# Altium schematic sheet DC309A_External_Sync.SchDoc: External_Sync
size 558 x 431 mm; Date: Not shown in title block; ApprovedBy: Not shown in title block; CheckedBy: Not shown in title block; Author: Not shown in title block; CompanyName: Not shown in title block; DrawnBy: KAVIKANNAN; Engineer: Not shown in title block; Organization: Not shown in title block; Address1: Not shown in title block; Address2: Not shown in title block; Address3: Not shown in title block; Address4: Not shown in title block; DocumentNumber: 8; Revision: Use project parameter SCH_Rev; SheetNumber: 8; SheetTotal: 11; PageSetup: Record=PageOptions|CenterHorizontal=True|CenterVertical=True|PrintScale=1.00|XCorrection=1.00|YCorrection=1.00|PrintKind=0|BorderSize=5000000|LeftOffset=0|BottomOffset=0|Orientation=2|PaperLength=1000|PaperWidth=1000|Scale=100|PaperSource=15|PrintQuality=600|MediaType=1|DitherType=10|PaperKind=Letter|PrintScaleMode=1; CurrentTime: Not shown in title block; CurrentDate: Not shown in title block; Time: Not shown in title block; DocumentFullPathAndName: Not shown in title block; DocumentName: Not shown in title block; ModifiedDate: Not shown in title block; ImagePath: Not shown in title block
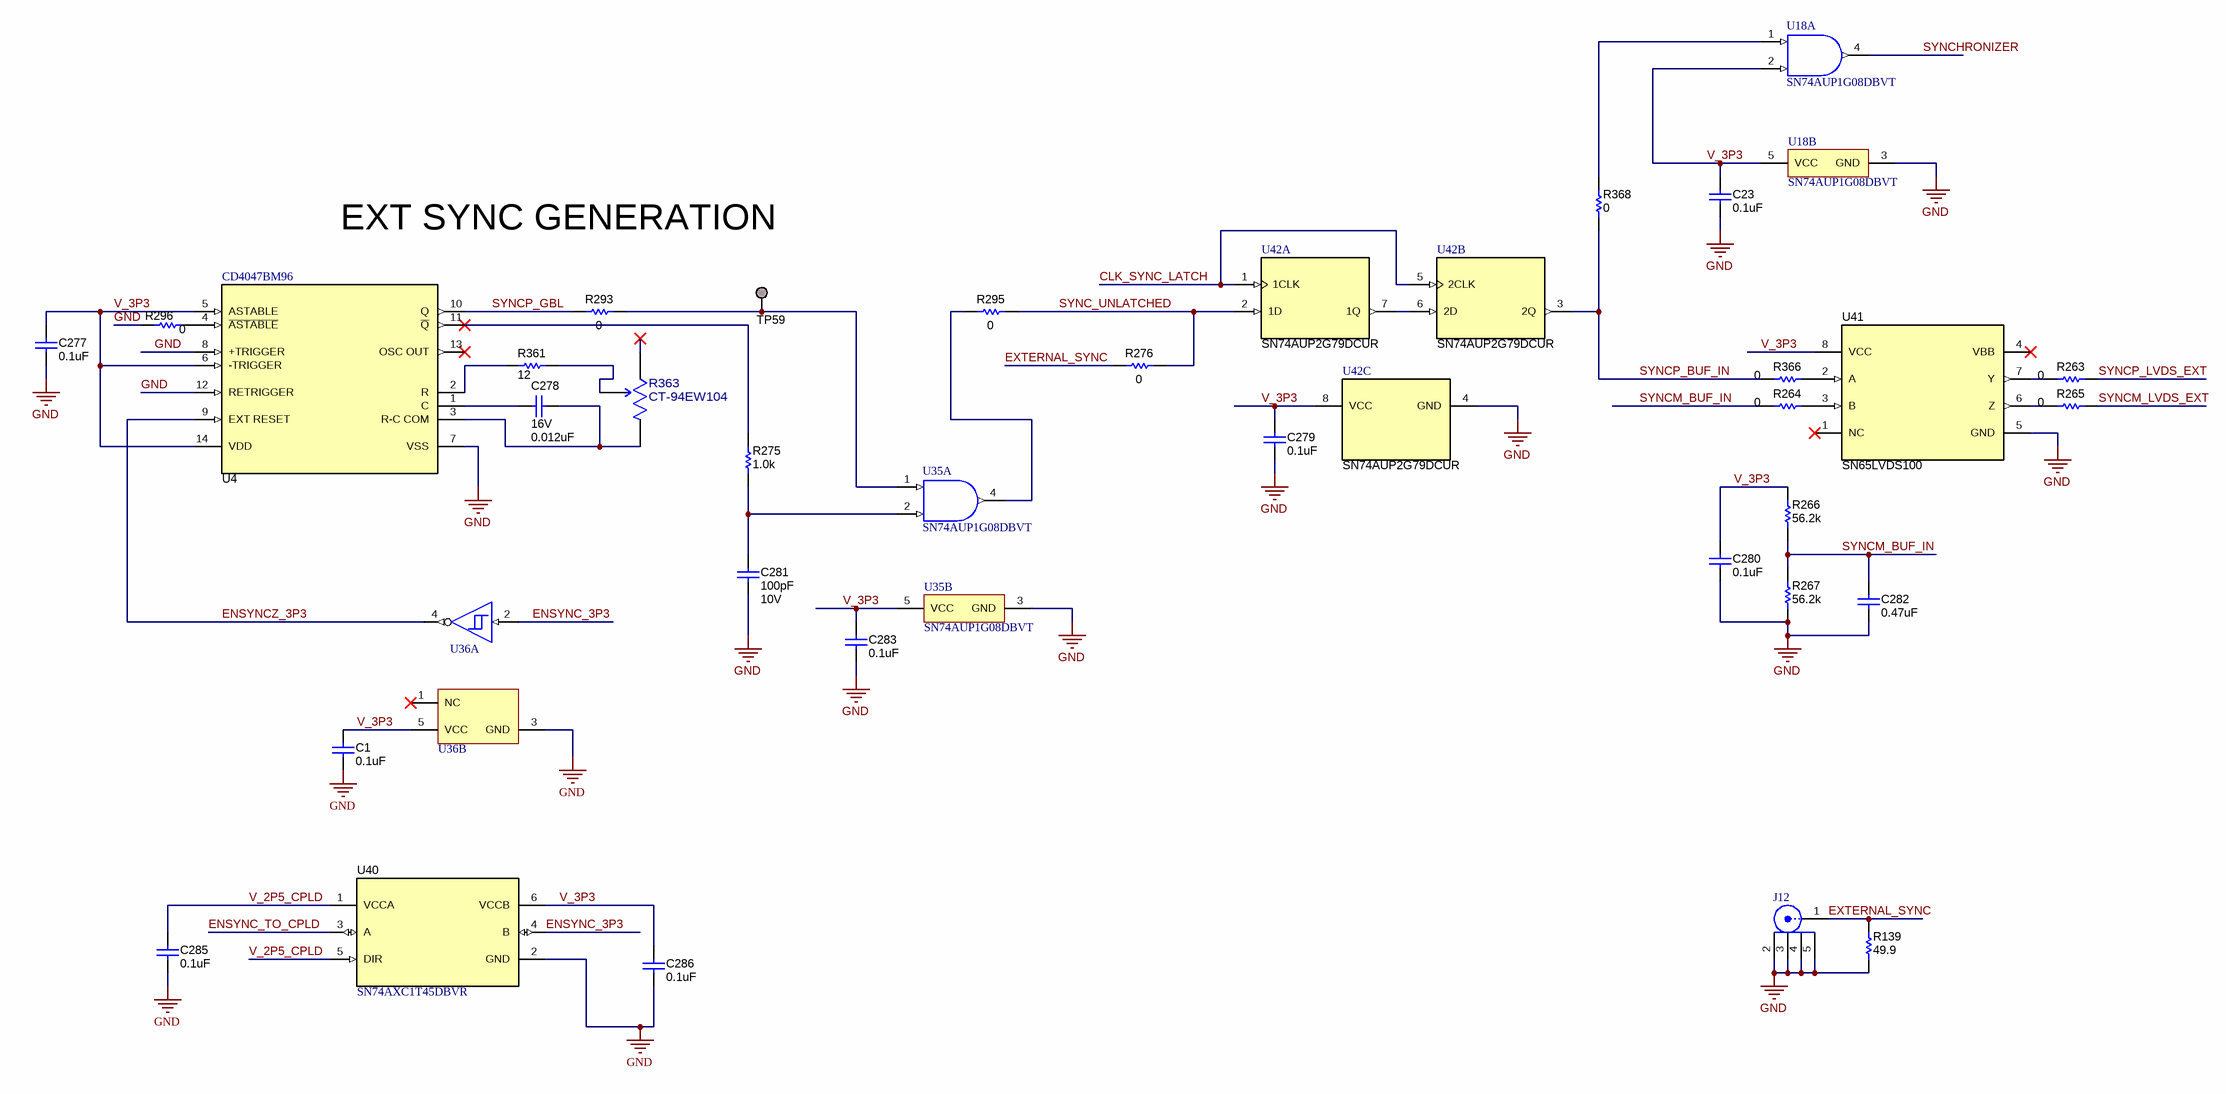
[diagram p0: DC309A_External_Sync.SchDoc]

## Parts
C1  value 0.1uF  [0402]  (hidden comment: Capacitor)
C23  ValueDisplayed: 0.1uF  [0402]  (hidden comment: Capacitor)
C277  ValueDisplayed: 0.1uF  [0402]  (hidden comment: Capacitor)
C278  VDC_V: 16V  ValueDisplayed: 0.012uF  [0402]  (hidden comment: GRM155R71C123KA01D)
C279  ValueDisplayed: 0.1uF  [0402]  (hidden comment: Capacitor)
C280  ValueDisplayed: 0.1uF  [0402]  (hidden comment: Capacitor)
C281  Cap_F: 100pF  VDC_V: 10V  [0603]  (hidden comment: 0603ZC101KAT2A)
C282  ValueDisplayed: 0.47uF  [0402]  (hidden comment: Capacitor)
C283  ValueDisplayed: 0.1uF  [0402]  (hidden comment: Capacitor)
C285  value 0.1uF  [0402]  (hidden comment: Capacitor)
C286  value 0.1uF  [0402]  (hidden comment: Capacitor)
J12  901-144-8RFX  [AMPHENOL_901-144-8RFX]  (value not drawn)
R139  ValueDisplayed: 49.9  [TNPW0603]  (hidden comment: TNPW060349R9BEEA)
R263  value 0  [0402]  (hidden comment: Resistor)
R264  value 0  [0402]  (hidden comment: Resistor)
R265  value 0  [0402]  (hidden comment: Resistor)
R266  ValueDisplayed: 56.2k  [0402]  (hidden comment: Resistor)
R267  ValueDisplayed: 56.2k  [0402]  (hidden comment: Resistor)
R275  ValueDisplayed: 1.0k  [0402]  (hidden comment: CRCW04021K00JNED)
R276  value 0  [0402]  (hidden comment: Resistor)
R293  value 0  [0402]  (hidden comment: Resistor)
R295  value 0  [0402]  (hidden comment: Resistor)
R296  ValueDisplayed: 0  [0402]  (hidden comment: Resistor)
R361  ValueDisplayed: 12  [0402]  (hidden comment: CRCW040212R0JNED)
R363  CT-94EW104  [FP-CT-94EW104_PTH_POTEN_9MM6_4MM8-MFG]
R366  value 0  [0402]  (hidden comment: Resistor)
R368  value 0  [0402]  (hidden comment: Resistor)
TP59  Test Point  [TP_50MIL-SMT]  (value not drawn)  (no BOM)
U4  CD4047BM96  [D0014A_N]
U18  SN74AUP1G08DBVT  [DBV0005A_N]  (parts A,B of 2)
U35  SN74AUP1G08DBVT  [DBV0005A_N]  (parts A,B of 2)
U36  SN74LVC1G14DBVR  [DBV0005A_N]  (value not drawn)  (parts A,B of 2)
U40  SN74AXC1T45DBVR  [DBV0006A_N]
U41  SN65LVDS100  [DGK0008A_N]
U42  SN74AUP2G79DCUR  [DCU0008A_N]  (parts A,B,C of 3)

## Nets
GND: C1.1 C23.2 C277.2 C279.2 C280.2 C281.1 C282.2 C283.2 C285.1 C286.1 J12.2 J12.3 J12.4 J12.5 R139.1 R267.1 R296.1 U4.7(VSS) U4.8(+TRIGGER) U4.12(RETRIGGER) U18.3(GND) U35.3(GND) U36.3(GND) U40.2(GND) U41.5(GND) U42.4(GND)
CLK_SYNC_LATCH: U42.1(1CLK) U42.5(2CLK)
ENSYNC_3P3: U36.2(A) U40.4(B)
ENSYNC_TO_CPLD: U40.3(A)
ENSYNCZ_3P3: U4.9(EXT_RESET) U36.4(Y)
EXTERNAL_SYNC: J12.1 R139.2 R276.2
SYNC_UNLATCHED: R276.1 R295.1 U42.2(1D)
SYNCHRONIZER: U18.4(Y)
SYNCM_BUF_IN: C282.1 R264.2 R266.1 R267.2
SYNCM_LVDS_EXT: R265.1
SYNCP_BUF_IN: R366.2 R368.1 U42.3(2Q)
SYNCP_GBL: R293.2 U4.10(Q)
SYNCP_LVDS_EXT: R263.1
V_2P5_CPLD: C285.2 U40.1(VCCA) U40.5(DIR)
V_3P3: C1.2 C23.1 C277.1 C279.1 C280.1 C283.1 C286.2 R266.2 U4.5(ASTABLE) U4.6(-TRIGGER) U4.14(VDD) U18.2(B) U18.5(VCC) U35.5(VCC) U36.5(VCC) U40.6(VCCB) U41.8(VCC) U42.8(VCC)
NetC278_1: C278.1 R363.3 U4.3(R-C_COM)
NetC278_2: C278.2 U4.1(C)
NetC281_2: C281.2 R275.2 U35.2(B)
NetR263_2: R263.2 U41.7(Y)
NetR264_1: R264.1 U41.3(B)
NetR265_2: R265.2 U41.6(Z)
NetR275_1: R275.1 U4.11(~{Q})
NetR293_1: R293.1 TP59.1 U35.1(A)
NetR295_2: R295.2 U35.4(Y)
NetR296_2: R296.2 U4.4(~{ASTABLE})
NetR361_1: R361.1 U4.2(R)
NetR361_2: R361.2 R363.2
NetR366_1: R366.1 U41.2(A)
NetR368_2: R368.2 U18.1(A)
NetU42_6: U42.6(2D) U42.7(1Q)

Not connected (* = marked no-connect by the designer): R363 1*; U4 13(OSC_OUT)*; U36 1(NC)*; U41 1(NC)* 4(VBB)*

## Notes on the sheet
- EXT SYNC GENERATION
- Drawn By:
- SVN Rev:
- Number:
- TID #:
- Orderable:
- Rev:
- Sheet Title:
- File:
- Project Title:
- Designed for:
- Assembly Variant:
- Mod. Date:
- Sheet:
- Size:
- of
- C
- http://www.ti.com
- Texas Instruments and/or its licensors do not warrant the accuracy or completeness of this specification or any information contained therein. Texas Instruments and/or its licensors do not warrant that this design will meet the specifications, will be suitable for your application or fit for any particular purpose, or will operate in an implementation. Texas Instruments and/or its licensors do not warrant that the design is production worthy. You should completely validate and test your design implementation to confirm the system functionality for your application.
- Engineer:
- Contact:
- © Texas Instruments

## Library data of the parts
C1 C285 C286 = CMP-0006641-2: CAP, CERM, 0.1 uF, 16 V, +/- 10%, X7R, 0402; PartNumber: GRM155R71C104KA88D; Manufacturer: MuRata; Polarized: N; U/M: EA; Cap_F: 100nF; Value1: Unknown; VDC_V: 16V; TaMin_C: -55°C; TaMax_C: 125°C; AEC Category: Q200; SizeArea_mm2: 0.5; SizeAreaWB_mm2: 3; SizeX_mm: 1; SizeZ_mm: 0.6; CompType: Capacitor; PackageReference: 0402; RoHS: Y; MountType: SMT; ComponentLink1Description: Datasheet link; ComponentLink1URL: http://search.murata.co.jp/Ceramy/PnsearchViewAction.do?HnOFG=ON&HnNFG=ON&SEL_CNT=50&sLang=en&sKey=GRM155R71C104KA88D&x=9&y=9&search=startwith; ValueDisplayed: 0.1uF; Tolerance_%: 10%; Value2: 16V; Technology: Ceramic; TempCo: X7R; Cap_Case: 0402; Published: 2008-06-19; Publisher: Texas Instruments; LatestRevisionDate: 2017-03-09; Supplier 1: Digi-Key; Supplier Part Number 1: 490-3261-1-ND; Supplier 2: Newark; Supplier Part Number 2: 38K1647; Supplier 3: Mouser; Supplier Part Number 3: 81-GRM155R71C104KA88; AEC Qualified: ?; SizeY_mm: 0.5
C23 C279 C280 C283 = CMP-0006201-2: CAP, CERM, 0.1 uF, 16 V, +/- 10%, X7R, 0402; PartNumber: 0402YC104KAT2A; Manufacturer: AVX; Polarized: N; Value: 0.1uF; U/M: EA; Cap_F: 100nF; Value1: Unknown; VDC_V: 16V; TaMin_C: -55°C; TaMax_C: 125°C; SizeArea_mm2: 0.5; SizeAreaWB_mm2: 3; SizeX_mm: 1; SizeZ_mm: 0.6; AEC Category: Q200; CompType: Capacitor; PackageReference: 0402; RoHS: Y; Tolerance_%: 10%; Value2: 16V; MountType: SMT; Technology: Ceramic; TempCo: X7R; Cap_Case: 0402; SizeY_mm: 0.5; Published: 2008-06-19; Publisher: Texas Instruments; LatestRevisionDate: 2017-03-09; ComponentLink1Description: Datasheet link; ComponentLink1URL: http://catalogs.avx.com/SurfaceMount.pdf; Supplier 1: Digi-Key; Supplier Part Number 1: 478-7888-1-ND; Supplier 2: Newark; Supplier Part Number 2: 09R7024; Supplier 3: Mouser; Supplier Part Number 3: 581-0402YC104KAT2A; AEC Qualified: N; AEC Grade: N/A
C277 = CMP-0006255-2: CAP, CERM, 0.1 uF, 6.3 V, +/- 10%, X5R, 0402; PartNumber: C1005X5R0J104K050BA; Manufacturer: TDK; Polarized: N; Value: 0.1uF; U/M: EA; Cap_F: 100nF; ESR_ohm: 0.0186; Value1: 0.0186 ohm; VDC_V: 6.3V; TaMin_C: -55°C; TaMax_C: 85°C; SizeArea_mm2: 0.5; SizeAreaWB_mm2: 3; SizeX_mm: 1; SizeZ_mm: 0.6; AEC Category: Q200; CompType: Capacitor; PackageReference: 0402; RoHS: Y; Tolerance_%: 10%; Value2: 6.3V; MountType: SMT; Technology: Ceramic; TempCo: X5R; Cap_Case: 0402; SizeY_mm: 0.5; Published: 2008-06-19; Publisher: Texas Instruments; LatestRevisionDate: 2017-03-09; ComponentLink1Description: Datasheet link; ComponentLink1URL: http://www.tdk.co.jp/tefe02/e412_c.pdf; Supplier 1: Digi-Key; Supplier Part Number 1: 445-1266-1-ND; Supplier 2: Newark; Supplier Part Number 2: 90R7579; Supplier 3: Mouser; Supplier Part Number 3: 810-C1005X5R0J104K; AEC Qualified: ?
C278 = CMP-0006642-2: CAP, CERM, 0.012 uF, 16 V, +/- 10%, X7R, 0402; Manufacturer: MuRata; TaMin_C: -55°C; Polarized: N; SizeAreaWB_mm2: 3; Value1: Unknown; U/M: EA; TaMax_C: 125°C; SizeZ_mm: 0.6; SizeX_mm: 1; SizeY_mm: 0.5; Cap_F: 12nF; AEC Category: Q200; Supplier Part Number 2: 81-GRM155R71C123KA1D; Publisher: Texas Instruments; Supplier 2: Mouser; TempCo: X7R; Published: 2008-06-19; RoHS: Y; MountType: SMT; Value: 0.012uF; Supplier 1: Digi-Key; PackageReference: 0402; Tolerance_%: 10%; Cap_Case: 0402; Value2: 16V; SizeArea_mm2: 0.5; CompType: Capacitor; LatestRevisionDate: 2017-03-09; PartNumber: GRM155R71C123KA01D; AEC Qualified: ?; ComponentLink1Description: Datasheet link; Supplier Part Number 1: 490-3255-1-ND; Technology: Ceramic; ComponentLink1URL: http://search.murata.co.jp/Ceramy/PnsearchViewAction.do?HnOFG=ON&HnNFG=ON&SEL_CNT=50&sLang=en&sKey=GRM155R71C123KA01D&x=9&y=9&search=startwith
C281 = CMP-0006812-2: CAP, CERM, 100 pF, 10 V, +/- 10%, X7R, 0603; Manufacturer: AVX; TaMin_C: -55°C; Polarized: N; SizeAreaWB_mm2: 4.68; Value1: Unknown; U/M: EA; Value: 100pF; TaMax_C: 125°C; SizeZ_mm: 1; SizeX_mm: 1.6; SizeY_mm: 0.8; SizeArea_mm2: 1.28; AEC Category: Q200; Supplier Part Number 2: 55J2751; Publisher: Texas Instruments; Supplier 2: Newark; Supplier Part Number 3: 581-0603ZC101KAT2A; TempCo: X7R; Supplier 3: Mouser; Published: 2008-06-19; RoHS: Y; MountType: SMT; Supplier 1: Digi-Key; PackageReference: 0603; Tolerance_%: 10%; Cap_Case: 0603; Value2: 10V; CompType: Capacitor; LatestRevisionDate: 2017-03-09; PartNumber: 0603ZC101KAT2A; AEC Qualified: N; ComponentLink1Description: Datasheet link; AEC Grade: N/A; Supplier Part Number 1: 0603ZC101KAT2A-ND; Technology: Ceramic; ValueDisplayed: 100pF; ComponentLink1URL: http://datasheets.avx.com/X7RDielectric.pdf
C282 = CMP-0006199-2: CAP, CERM, 0.47 uF, 6.3 V, +/- 10%, X5R, 0402; PartNumber: 04026D474KAT2A; Manufacturer: AVX; Polarized: N; Value: 0.47uF; U/M: EA; Cap_F: 470nF; Value1: Unknown; VDC_V: 6.3V; TaMin_C: -55°C; TaMax_C: 85°C; SizeArea_mm2: 0.5; SizeAreaWB_mm2: 3; SizeX_mm: 1; SizeZ_mm: 0.6; AEC Category: Q200; CompType: Capacitor; PackageReference: 0402; RoHS: Y; Tolerance_%: 10%; Value2: 6.3V; MountType: SMT; Technology: Ceramic; TempCo: X5R; Cap_Case: 0402; SizeY_mm: 0.5; Published: 2008-06-19; Publisher: Texas Instruments; LatestRevisionDate: 2017-03-09; ComponentLink1Description: Datasheet link; ComponentLink1URL: http://catalogs.avx.com/SurfaceMount.pdf; Supplier 1: Digi-Key; Supplier Part Number 1: 478-6196-1-ND; Supplier 2: Newark; Supplier Part Number 2: 60R6163; Supplier 3: Mouser; Supplier Part Number 3: 581-04026D474KAT2A; AEC Qualified: N; AEC Grade: N/A
J12 = CMP-0055833-1: SMA Straight Jack, Gold, 50 Ohm, TH; Manufacturer: Amphenol RF; CNHeader: FALSE; Green_Lifecycle: Not Set; Green_REACh: Incomplete; CT: TRUE; ComponentLink1URL: http://www.amphenolinfocom.eu/NavData/Drawings/C901-144-8RFX.pdf; Supplier Part Number 2: 34C8151; Publisher: Texas Instruments; Supplier 2: Newark; Supplier Part Number 3: 523-901-144-8RFX; Supplier 3: Mouser; RoHS: Y; MountType: TH; Green_EU RoHS-2: Incomplete; Supplier 1: Digi-Key; Green_EU RoHS: Incomplete; PackageReference: SMA Straight Jack, TH; CompType: SMA; LatestRevisionDate: 26/05/2017; PartNumber: 901-144-8RFX; ComponentLink1Description: Datasheet URL; Supplier Part Number 1: ARFX1231-ND
R139 = CMP-0025693-1: RES, 49.9, 0.1%, 0.1 W, AEC-Q200 Grade 1, 0603; Manufacturer: Vishay-Dale; Power_W: 100mW; TempCo: 25 ppm/C; Value_Code: 49R9; U/M: EA; Value: 49.9; EIA_Code: E192; SizeX_mm: 1.6; SizeY_mm: 0.85; SizeZ_mm: 0.55; Value2: 0.1W; SizeArea_mm2: 1.36; AEC Qualified: Y; VDC_V: 75V; AEC Grade: 1; AEC Category: Q200; ComponentLink1URL: http://www.vishay.com/docs/28758/tnpw_e3.pdf; Supplier Part Number 2: 05R4782; Publisher: Texas Instruments; Supplier 2: Newark; Supplier Part Number 3: 71-TNPW060349R9BEEA; Supplier 3: Mouser; Published: 2008-06-26; RoHS: Y; Value1: 0.1%; MountType: SMT; Supplier 1: Digi-Key; PackageReference: 0603; Tolerance_%: 0.1%; Res_ohm: 49.9; CompType: Resistor; LatestRevisionDate: 2017-03-09; PartNumber: TNPW060349R9BEEA; ComponentLink1Description: Datasheet link; Supplier Part Number 1: 541-2031-1-ND; Technology: Thin Film
R263-R265 R276 R293 R295 R366 R368 = CMP-0026992-3: RES, 0, 5%, 0.1 W, AEC-Q200 Grade 0, 0402; PartNumber: ERJ-2GE0R00X; Manufacturer: Panasonic; Value_Code: 0000; Power_W: 100mW; Value2: 0.1W; VDC_V: 50V; TempCo: 600 ppm/C; SizeArea_mm2: 0.5; SizeX_mm: 1; SizeZ_mm: 0.6; EIA_Code: E24; AEC Category: Q200; AEC Qualified: Y; SizeAreaWB_mm2: 3; CompType: Resistor; PackageReference: 0402; RoHS: Y; Res_ohm: 0; Tolerance_%: 5%; Value1: 5%; MountType: SMT; Technology: Thick Film; SizeY_mm: 0.5; ComponentLink1Description: Datasheet link; ComponentLink1URL: https://industrial.panasonic.com/cdbs/www-data/pdf/RDA0000/AOA0000C301.pdf; Supplier 1: Digi-Key; Supplier Part Number 1: P0.0JCT-ND; Supplier 2: Newark; Supplier Part Number 2: 65T8307; Supplier 3: Mouser; Supplier Part Number 3: 667-ERJ-2GE0R00X; AEC Grade: 0; ValueDisplayed: 0
R266 R267 = CMP-0026453-2: RES, 56.2 k, 1%, 0.063 W, AEC-Q200 Grade 0, 0402; PartNumber: CRCW040256K2FKED; Manufacturer: Vishay-Dale; Value: 56.2k; Value_Code: 56k2; Power_W: 63mW; Value2: 0.063W; VDC_V: 50V; TempCo: 100 ppm/C; SizeArea_mm2: 0.5; SizeX_mm: 1; SizeZ_mm: 0.6; EIA_Code: E96; AEC Category: Q200; AEC Qualified: Y; AEC Grade: 0; CompType: Resistor; PackageReference: 0402; RoHS: E; Res_ohm: 56.2k; Tolerance_%: 1%; Value1: 1%; MountType: SMT; Technology: Thick Film; SizeY_mm: 0.5; ComponentLink1Description: Datasheet link; ComponentLink1URL: http://www.vishay.com/docs/20035/dcrcwe3.pdf; Supplier 1: Digi-Key; Supplier Part Number 1: 541-56.2KLCT-ND; Supplier 2: Newark; Supplier Part Number 2: 52K7159; Supplier 3: Mouser; Supplier Part Number 3: 71-CRCW0402-56.2K-E3
R275 = CMP-0026852-1: RES, 1.0 k, 5%, 0.063 W, 0402; Manufacturer: Vishay-Dale; Power_W: 63mW; TempCo: 200 ppm/C; Value_Code: 1k00; U/M: EA; Value: 1.0k; EIA_Code: E24; Res_ohm: 1k; SizeX_mm: 1; SizeY_mm: 0.5; SizeZ_mm: 0.6; Value2: 0.063W; VDC_V: 50V; AEC Category: Q200; ComponentLink1URL: http://www.vishay.com/docs/20035/dcrcwe3.pdf; Supplier Part Number 2: 59M6691; Publisher: Texas Instruments; Supplier 2: Newark; Supplier Part Number 3: 71-CRCW0402J-1.0K-E3; Supplier 3: Mouser; Published: 2008-06-26; RoHS: Y; Value1: 5%; MountType: SMT; Supplier 1: Digi-Key; PackageReference: 0402; Tolerance_%: 5%; SizeArea_mm2: 0.5; CompType: Resistor; LatestRevisionDate: 2017-03-09; PartNumber: CRCW04021K00JNED; AEC Qualified: ?; ComponentLink1Description: Datasheet link; Supplier Part Number 1: 541-1.0KJCT-ND; Technology: Thick Film
R296 = CMP-0026822-3: RES, 0, 5%, 0.063 W, AEC-Q200 Grade 0, 0402; PartNumber: CRCW04020000Z0ED; Manufacturer: Vishay-Dale; Value: 0; Value_Code: 0000; Power_W: 63mW; Value2: 0.063W; VDC_V: 50V; TempCo: 200 ppm/C; EIA_Code: E24; AEC Category: Q200; AEC Qualified: Y; SizeArea_mm2: 0.5; SizeX_mm: 1; SizeZ_mm: 0.6; CompType: Resistor; PackageReference: 0402; RoHS: E; Res_ohm: 0; Tolerance_%: 5%; Value1: 5%; MountType: SMT; Technology: Thick Film; ComponentLink1Description: Datasheet link; ComponentLink1URL: http://www.vishay.com/docs/20035/dcrcwe3.pdf; Supplier 1: Digi-Key; Supplier Part Number 1: 541-0.0JCT-ND; Supplier 2: Newark; Supplier Part Number 2: 52K6543; Supplier 3: Mouser; Supplier Part Number 3: 71-CRCW0402-0-E3; AEC Grade: 0; SizeY_mm: 0.5
R361 = CMP-0026835-3: RES, 12, 5%, 0.063 W, AEC-Q200 Grade 0, 0402; Manufacturer: Vishay-Dale; Power_W: 63mW; TempCo: 200 ppm/C; Value_Code: 12R0; Value: 12; EIA_Code: E24; SizeX_mm: 1; SizeY_mm: 0.5; SizeZ_mm: 0.6; Value2: 0.063W; AEC Qualified: Y; VDC_V: 50V; AEC Category: Q200; AEC Grade: 0; Supplier Part Number 2: 59M6701; Supplier 2: Newark; Supplier Part Number 3: 71-CRCW0402J-12-E3; Supplier 3: Mouser; RoHS: E; Value1: 5%; MountType: SMT; Supplier 1: Digi-Key; PackageReference: 0402; Tolerance_%: 5%; Res_ohm: 12; SizeArea_mm2: 0.5; CompType: Resistor; PartNumber: CRCW040212R0JNED; ComponentLink1Description: Datasheet link; Supplier Part Number 1: 541-12JCT-ND; Technology: Thick Film; ComponentLink1URL: http://www.vishay.com/docs/20035/dcrcwe3.pdf
R363 = CMP-0119977-1: 100 kOhms 0.5W, 1/2W PC Pins Through Hole Trimmer Potentiometer Cermet 18.0 Turn Top Adjustment; Manufacturer: Nidec Components; SizeZ_mm: 11.3mm; Value: 100kΩ; AEC Qualified: No; TempCo: 100ppm/°C; Tolerance_%: 10%; VDC_V: 300V; PackageReference: PTH_POTEN_9MM6_4MM8; PartNumber: CT-94EW104; RoHS: TRUE; Part Number: CT-94EW104; datasheet: https://www.nidec-components.com/e/catalog/trimmer/ct-94.pdf; Datasheet Path: datasheets/Res-CT-94EW104.pdf; Digikey Description: TRIMMER 100K OHM 0.5W PC PIN TOP; Digikey Part Number: 563-CT-94EW104-ND; helpURL: https://upverter.com/upn/revision/b7c3f4141cf1048a/; Lead Free: Yes; Mouser Part Number: 229-CT-94EW104; Operating Temperature Range: -55°C to +125°C; Power_W: 0.5W; Res_ohm: 100kΩ; Series: CT-94; Technology: Cermet; ComponentLink1Description: Datasheet; ComponentLink1URL: https://www.nidec-components.com/e/catalog/trimmer/ct-94.pdf
TP59 = CMP-0078143-2: TEST POINT.  No entry in BOM.; PackageReference: N/A; CompType: Testpoint; Manufacturer: N/A; PartNumber: N/A; Library Reference: TESTPOINT
U4 = CMP-0052286-1: CMOS Low-Power Monostable/Astable Multivibrator, D0014A, LARGE T&R; Manufacturer: Texas Instruments; VCC(Max)(V): 18; F @ Nom Voltage(Max)(Mhz): 8; tpd @ Nom Voltage(Max)(ns): 450; Rating: Military; Technology Family: CD4000; Output Drive (IOL/IOH)(Max)(mA): 4/-4; Bits(#): 1; VCC(Min)(V): 3; ICC @ Nom Voltage(Max)(mA): 0.06; Voltage(Nom)(V): 10; Generic Part Number: CD4047B; DatasheetVersion: SCHS044C; Output Type: CMOS; Code_JEDEC: MS-012; Input Type: CMOS; Operating Temperature Range(C): -55 to 125; PackageReference: D0014A
U18 U35 = CMP-0051576-2: Low-Power Single 2-Input Positive-AND Gate, DBV0005A (SOT-23-5); Manufacturer: Texas Instruments; 3-State Output: No; Output Type: CMOS; F @ Nom Voltage(Max)(Mhz): 100; Rating: Catalog; Voltage(Nom)(V): 0.8,1.2,1.5,1.8,2.5,3.3; Logic: True; Output Drive (IOL/IOH)(Max)(mA): 20/-20; tpd @ Nom Voltage(Max)(ns): 32.8,20.9,14.2,11,7.6,6.2; Bits(#): 1; ICC @ Nom Voltage(Max)(mA): 0.0009; Gate Type: AND; VCC(Max)(V): 3.6; VCC(Min)(V): 0.8; AEC Category: Q200; AEC Qualified: N; CompType: IC; SizeAreaWB_mm2: 14.82; SizeArea_mm2: 8.12; SizeX_mm: 2.8; SizeY_mm: 2.9; SizeZ_mm: 1.45; PackageReference: DBV0005A; Generic Part Number: SN74AUP1G08; Input Type: CMOS; Schmitt Trigger: No; ComponentLink1Description: Datasheet Link; ComponentLink1URL: http://www.ti.com/lit/ds/symlink/sn74aup1g08.pdf; ComponentLink2Description: Product Folder; ComponentLink2URL: http://www.ti.com/product/sn74aup1g08; ComponentLink3Description: Online Datasheet; ComponentLink3URL: http://www.ti.com/product/sn74aup1g08/datasheet; MountType: SMT; Operating Temperature Range: -40 to 85 C; PackageDescription: SOT-23-5; PartNumber: SN74AUP1G08DBVT; PartId: 1
U36 = CMP-0051642-1: Single Schmitt-Trigger Inverter, DBV0005A, LARGE T&R; Manufacturer: Texas Instruments; Input Type: CMOS/TTL; Output Drive (IOL/IOH)(Max)(mA): 32/-32; VCC(Min)(V): 1.65; 3-State Output: No; Schmitt Trigger: Yes; tpd @ Nom Voltage(Max)(ns): 11,6.5,5.5,5; VCC(Max)(V): 5.5; Output Type: CMOS; Bits(#): 1; Voltage(Nom)(V): 1.8,2.5,3.3,5; Sub-Family: Inverting Buffer/Driver; Logic: Inverting; Technology Family: LVC; F @ Nom Voltage(Max)(Mhz): 150; Rating: Catalog; ICC @ Nom Voltage(Max)(mA): 0.01; DatasheetVersion: SCES218W; PackageReference: DBV0005A; Generic Part Number: SN74LVC1G14; Operating Temperature Range(C): -40 to 125,-40 to 85; PartId: 1
U40 = CMP-0081177-1: Single-Bit Dual-Supply Bus Transceiver, DBV0006A (SOT-23-6); Alternate Manufacturer: Texas Instruments; SizeAreaWB_mm2: 14.82; SizeZ_mm: 1.45; SizeX_mm: 2.8; SizeY_mm: 2.9; SizeArea_mm2: 8.12; CompType: IC; AEC Qualified: N; AEC Category: Q200; ComponentLink1URL: http://www.ti.com/lit/ds/symlink/sn74axc1t45.pdf; PackageDescription: SOT-23-6; MountType: SMT; ComponentLink2URL: http://www.ti.com/product/sn74axc1t45; ComponentLink3Description: Online Datasheet; ComponentLink2Description: Product Folder; Manufacturer: Texas Instruments; ComponentLink3URL: http://www.ti.com/product/sn74axc1t45/datasheet; PackageReference: DBV0006A; PartNumber: SN74AXC1T45DBVR; ComponentLink1Description: Datasheet Link
U41 = CMP-0076021-2: 2 Gbps LVDS/LVPECL/CML to LVDS Buffer/Repeater/Translator, DGK0008A (VSSOP-8); PartNumber: SN65LVDS100DGKR; Alternate PartNumber: SN65LVDS100DGK; Manufacturer: Texas Instruments; SizeArea_mm2: 14.7; SizeAreaWB_mm2: 23.6; SizeX_mm: 4.9; SizeY_mm: 3; SizeZ_mm: 1.1; CompType: IC; AEC Category: Q200; AEC Qualified: N; PackageReference: DGK0008A; PackageDescription: VSSOP-8; MountType: SMT; ComponentLink1Description: Datasheet Link; ComponentLink1URL: http://www.ti.com/lit/ds/symlink/sn65lvds100.pdf; RoHS: Y; Alternate Manufacturer: Texas Instruments; Code_JEDEC: MO-187-AA; ComponentLink2Description: Product Folder; ComponentLink2URL: http://www.ti.com/product/sn65lvds100; ComponentLink3Description: Online Datasheet; ComponentLink3URL: http://www.ti.com/product/sn65lvds100/datasheet
U42 = CMP-0051197-2: Low-Power Dual Positive-Edge-Triggered D-Type Flip-Flop, DCU0008A (VSSOP-8); Manufacturer: Texas Instruments; ICC @ Nom Voltage(Max)(mA): 0.0009; 3-State Output: No; Input Type: CMOS; Rating: Catalog; Output Drive (IOL/IOH)(Max)(mA): 20/-20; VCC(Max)(V): 3.6; Bits(#): 2; Technology Family: AUP; Logic: True; Voltage(Nom)(V): 0.8,1.2,1.5,1.8,2.5,3.3; VCC(Min)(V): 0.8; tpd @ Nom Voltage(Max)(ns): 27.2,17.3,13.3,11.3,7.8,6.3; F @ Nom Voltage(Max)(Mhz): 100; AEC Category: Q200; AEC Qualified: N; CompType: IC; SizeAreaWB_mm2: 12.6; SizeArea_mm2: 6.4; SizeX_mm: 3.2; SizeY_mm: 2.0; SizeZ_mm: 0.9; Generic Part Number: SN74AUP2G79; PackageReference: DCU0008A; Schmitt Trigger: No; Output Type: CMOS; ComponentLink1Description: Datasheet Link; ComponentLink1URL: http://www.ti.com/lit/ds/symlink/sn74aup2g79.pdf; ComponentLink2Description: Product Folder; ComponentLink2URL: http://www.ti.com/product/sn74aup2g79; ComponentLink3Description: Online Datasheet; ComponentLink3URL: http://www.ti.com/product/sn74aup2g79/datasheet; MountType: SMT; Operating Temperature Range: -40 to 85 C; PackageDescription: VSSOP-8; PartNumber: SN74AUP2G79DCUR; PartId: 1